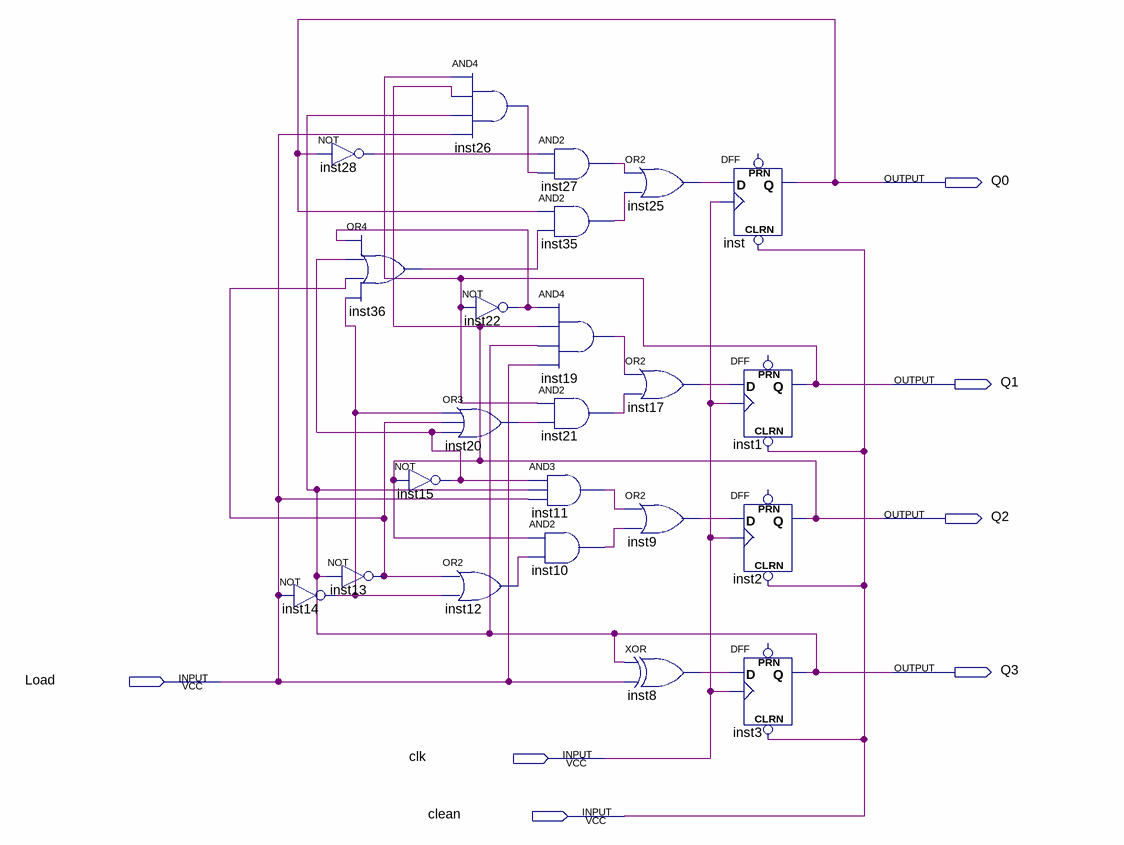
[diagram p0: schematic sheet]
// Quartus schematic wave.bdf as structural Verilog: 23 symbols, 7 pins
module wave (
  input  Load,
  input  clk,
  input  clean,
  output Q0,
  output Q1,
  output Q2,
  output Q3
);

  wire inst8_out, inst9_out, inst10_out, inst11_out, inst12_out, inst13_out, inst14_out, inst15_out,
       inst17_out, inst19_out, inst20_out, inst21_out, inst22_out, inst25_out, inst26_out, inst27_out,
       inst28_out, inst35_out, inst36_out;

  not inst14 (inst14_out, Load);
  not inst28 (inst28_out, Q0);
  or inst36 (inst36_out, inst22_out, inst15_out, inst13_out, inst14_out);
  not inst13 (inst13_out, Q3);
  and inst26 (inst26_out, Q1, Q2, Q3, Load);
  not inst22 (inst22_out, Q1);
  or inst20 (inst20_out, inst14_out, inst13_out, inst15_out);
  not inst15 (inst15_out, Q2);
  or inst12 (inst12_out, inst13_out, inst14_out);
  and inst27 (inst27_out, inst28_out, inst26_out);
  and inst35 (inst35_out, Q0, inst36_out);
  and inst19 (inst19_out, inst22_out, Q2, Q3, Load);
  and inst21 (inst21_out, Q1, inst20_out);
  and inst11 (inst11_out, inst15_out, Q3, Load);
  and inst10 (inst10_out, Q2, inst12_out);
  or inst25 (inst25_out, inst27_out, inst35_out);
  or inst17 (inst17_out, inst19_out, inst21_out);
  or inst9 (inst9_out, inst11_out, inst10_out);
  xor inst8 (inst8_out, Q3, Load);
  DFF inst (.CLRN(clean), .CLK(clk), .D(inst25_out), .Q(Q0));  // open: PRN
  DFF inst1 (.CLRN(clean), .CLK(clk), .D(inst17_out), .Q(Q1));  // open: PRN
  DFF inst2 (.CLRN(clean), .CLK(clk), .D(inst9_out), .Q(Q2));  // open: PRN
  DFF inst3 (.CLRN(clean), .CLK(clk), .D(inst8_out), .Q(Q3));  // open: PRN
endmodule
